# Altium schematic sheet Infrared Reception_Sch.SchDoc
size A4
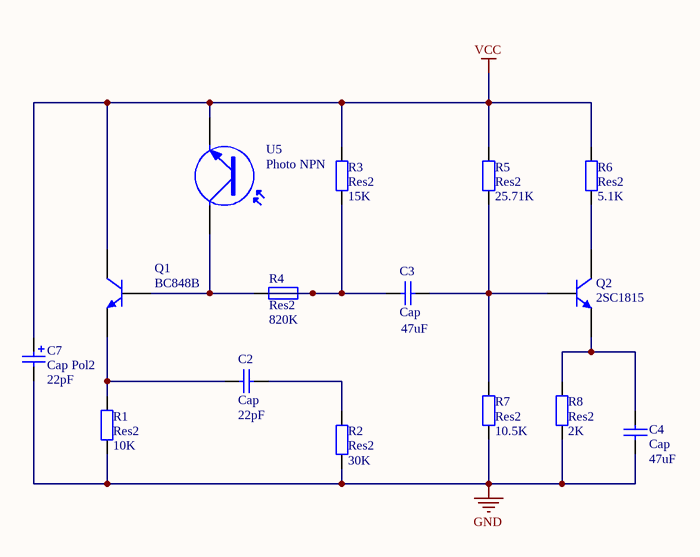
[diagram p0: Infrared Reception_Sch.SchDoc]

## Parts
C2  Cap  value 22pF  [RAD-0.3]
C3  Cap  value 47uF  [RAD-0.3]
C4  Cap  value 47uF  [RAD-0.3]
C7  Cap Pol2  value 22pF  [POLAR0.8]
Q1  BC848B  [TO-92A]
Q2  2SC1815  [TO-92A]
R1  Res2  value 10K  [AXIAL-0.4]
R2  Res2  value 30K  [AXIAL-0.4]
R3  Res2  value 15K  [AXIAL-0.4]
R4  Res2  value 820K  [AXIAL-0.4]
R5  Res2  value 25.71K  [AXIAL-0.4]
R6  Res2  value 5.1K  [AXIAL-0.4]
R7  Res2  value 10.5K  [AXIAL-0.4]
R8  Res2  value 2K  [AXIAL-0.4]
U5  Photo NPN  [TO-220_A]

## Nets
GND: C4.1 C7.2 R1.1 R2.1 R7.1 R8.1
VCC: C7.1 Q1.3(C) R3.2 R5.2 R6.2 U5.3(E)
NetC2_1: C2.1 Q1.1(E) R1.2
NetC2_2: C2.2 R2.2
NetC3_1: C3.1 R3.1 R4.1
NetC3_2: C3.2 Q2.2(B) R5.1 R7.2
NetC4_2: C4.2 Q2.1(E) R8.2
NetQ1_2: Q1.2(B) R4.2 U5.1(C)
NetQ2_3: Q2.3(C) R6.1

## Library data of the parts
C2-C4 = Cap: Capacitor; Published: 8-Jun-2000; LatestRevisionDate: 17-Jul-2002; LatestRevisionNote: Re-released for DXP Platform.; PackageReference: RAD-0.3; Publisher: Altium Limited; PackageDescription: Radial Cap, Thru-Hole; 2 Leads; 0.3 in Pin Spacing
C7 = Cap Pol2: Polarized Capacitor (Axial); Published: 8-Jun-2000; LatestRevisionDate: 17-Jul-2002; LatestRevisionNote: Re-released for DXP Platform.; PackageReference: POLAR0.8; Publisher: Altium Limited; PackageDescription: Polarized Capacitor; 2 Leads
Q1 Q2 = 2N3904: NPN General Purpose Amplifier; Published: 8-Jun-2000; LatestRevisionDate: 15-Jan-2003; LatestRevisionNote: PCB Footprint 'BCY-W3/D4.7' replaced; DatasheetVersion: 1997; PackageVersion: Sep-1998; PackageReference: TO-92A; Publisher: Altium Limited; PackageDescription: TO, Flat Index; 3 In-Line, Axial Leads; Body Dia. 4.5mm; Leads 0.51 x 0.48 mm (max); ComponentLink1Description: Manufacturer Link; ComponentLink1URL: http://www.fairchildsemi.com/; ComponentLink2Description: Datasheet; ComponentLink2URL: http://www.fairchildsemi.com/ds/2N%2F2N3904.pdf
R1-R8 = Res2: Resistor; Published: 8-Jun-2000; LatestRevisionDate: 17-Jul-2002; LatestRevisionNote: Re-released for DXP Platform.; PackageReference: AXIAL-0.4; Publisher: Altium Limited; PackageDescription: Axial Device, Thru-Hole; 2 Leads; 0.4 in Pin Spacing
U5 = Photo NPN: NPN Phototransistor; Published: 24-Mar-1999; LatestRevisionDate: 17-Jul-2002; LatestRevisionNote: Re-released for DXP Platform.; PackageReference: TO-220_A; Publisher: Altium Limited; Code_JEDEC: TO-220-AC